# EAGLE design Card4to16 (EAGLE 8.0.1)
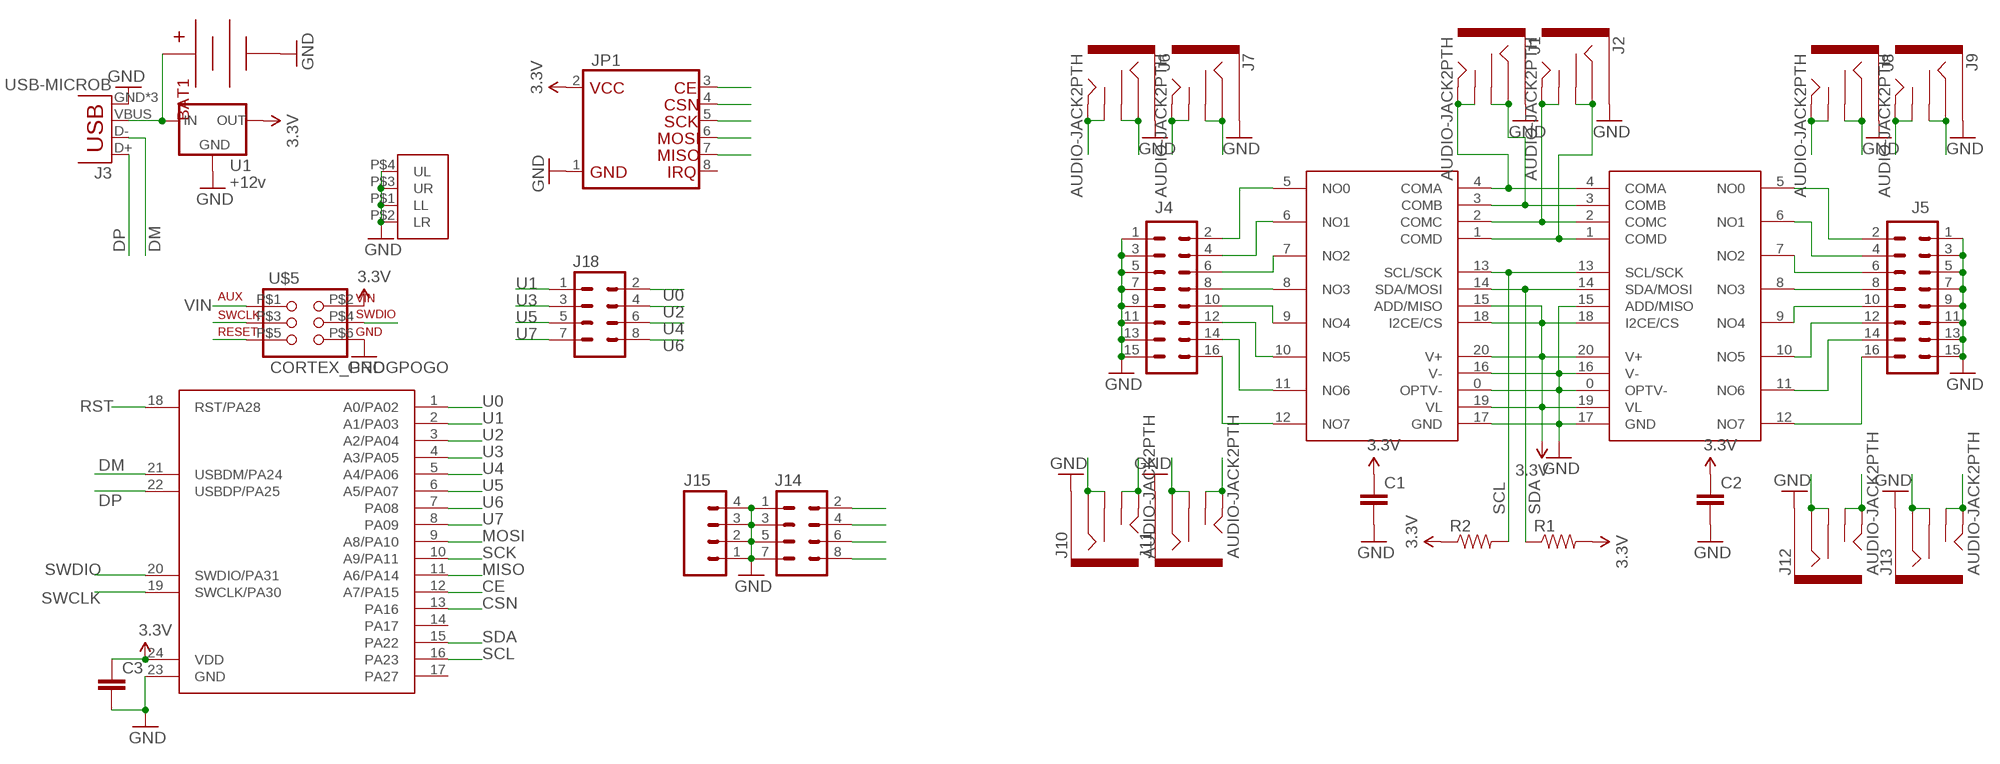
[diagram p0: schematic, sheet 1]

## Parts
BAT1  9VHOLDERCLIPS  [BSPC9V]
C1  CAP0805  [0805]
C2  CAP0805  [0805]
C3  CAP0805  [0805]
J1  AUDIO-JACK2PTH  [AUDIO-JACK]
J2  AUDIO-JACK2PTH  [AUDIO-JACK]
J3  USB-MICROB  [USB-MICROB]
J4  M08X2  [2X8]
J5  M08X2  [2X8]
J6  AUDIO-JACK2PTH  [AUDIO-JACK]
J7  AUDIO-JACK2PTH  [AUDIO-JACK]
J8  AUDIO-JACK2PTH  [AUDIO-JACK]
J9  AUDIO-JACK2PTH  [AUDIO-JACK]
J10  AUDIO-JACK2PTH  [AUDIO-JACK]
J11  AUDIO-JACK2PTH  [AUDIO-JACK]
J12  AUDIO-JACK2PTH  [AUDIO-JACK]
J13  AUDIO-JACK2PTH  [AUDIO-JACK]
J14  M04X2  [2X4]
J15  M04PTH  [1X04]
J18  M04X2  [2X4]
JP1  NRF24L01+SHORT_FLUSH  [NRF24L01SHORT]
R1  RESISTOR0603-RES  [0603-RES]
R2  RESISTOR0603-RES  [0603-RES]
U1  +12v  V_REG_78XX7812  [TO-252]
U$1  MAX14724ETP+QFN  [QFN20_4X4]
U$2  MAX14724ETP+QFN  [QFN20_4X4]
U$3  ATSAMD11D14A-M  [QFN24_4X4]
U$4  CARD_HOLESHOLES  [IEC-7810_ID-1_HOLES]
U$5  CORTEX_PROGPOGO  [2X3_MAX]

## Nets
3.3V: C1.1 C2.1 C3.1 JP1.2(VCC) R1.2 R2.1 U1.2(OUT) U$1.15(ADD/MISO) U$1.18(I2CE/CS) U$1.19(VL) U$1.20(V+) U$2.18(I2CE/CS) U$2.19(VL) U$2.20(V+) U$3.24(VDD) U$5.P$2(VIN)
CE: JP1.3(CE) U$3.12(A7/PA15)
COMA: J1.TIP J1.TSH J14.2 U$1.4(COMA) U$2.4(COMA)
COMB: J1.RING J1.RSH J14.4 U$1.3(COMB) U$2.3(COMB)
COMC: J2.TIP J2.TSH J14.6 U$1.2(COMC) U$2.2(COMC)
COMD: J2.RING J2.RSH J14.8 U$1.1(COMD) U$2.1(COMD)
CSN: JP1.4(CSN) U$3.13(PA16)
DM: J3.D- U$3.21(USBDM/PA24)
DP: J3.D+ U$3.22(USBDP/PA25)
GND: BAT1.P$1(V-) BAT1.P$2(V-) BAT1.P$3(V-) C1.2 C2.2 C3.2 J1.SLEEVE J2.SLEEVE J3.GND J3.MT1(GND) J3.MT2(GND) J4.1 J4.3 J4.5 J4.7 J4.9 J4.11 J4.13 J4.15 J5.1 J5.3 J5.5 J5.7 J5.9 J5.11 J5.13 J5.15 J6.SLEEVE J7.SLEEVE J8.SLEEVE J9.SLEEVE J10.SLEEVE J11.SLEEVE J12.SLEEVE J13.SLEEVE J14.1 J14.3 J14.5 J14.7 J15.1 J15.2 J15.3 J15.4 JP1.1(GND) U1.3(GND) U$1.0(OPTV-) U$1.16(V-) U$1.17(GND) U$2.0(OPTV-) U$2.15(ADD/MISO) U$2.16(V-) U$2.17(GND) U$3.23(GND) U$4.P$1(LL) U$4.P$2(LR) U$4.P$3(UR) U$4.P$4(UL) U$5.P$6(GND)
MISO: JP1.7(MISO) U$3.11(A6/PA14)
MOSI: JP1.6(MOSI) U$3.9(A8/PA10)
OUT1: J4.2 J10.RING J10.RSH U$1.5(NO0)
OUT2: J4.4 J10.TIP J10.TSH U$1.6(NO1)
OUT3: J4.6 J11.RING J11.RSH U$1.7(NO2)
OUT4: J4.8 J11.TIP J11.TSH U$1.8(NO3)
OUT5: J4.10 J12.RING J12.RSH U$1.9(NO4)
OUT6: J4.12 J12.TIP J12.TSH U$1.10(NO5)
OUT7: J4.14 J13.RING J13.RSH U$1.11(NO6)
OUT8: J4.16 J13.TIP J13.TSH U$1.12(NO7)
OUT9: J5.2 J6.RING J6.RSH U$2.5(NO0)
OUT10: J5.4 J6.TIP J6.TSH U$2.6(NO1)
OUT11: J5.6 J7.RING J7.RSH U$2.7(NO2)
OUT12: J5.8 J7.TIP J7.TSH U$2.8(NO3)
OUT13: J5.10 J8.RING J8.RSH U$2.9(NO4)
OUT14: J5.12 J8.TIP J8.TSH U$2.10(NO5)
OUT15: J5.14 J9.RING J9.RSH U$2.11(NO6)
OUT16: J5.16 J9.TIP J9.TSH U$2.12(NO7)
RST: U$3.18(RST/PA28) U$5.P$5(RST)
SCK: JP1.5(SCK) U$3.10(A9/PA11)
SCL: R2.2 U$1.13(SCL/SCK) U$2.13(SCL/SCK) U$3.16(PA23)
SDA: R1.1 U$1.14(SDA/MOSI) U$2.14(SDA/MOSI) U$3.15(PA22)
SWCLK: U$3.19(SWCLK/PA30) U$5.P$3(SWCLK)
SWDIO: U$3.20(SWDIO/PA31) U$5.P$4(SWDIO)
U0: J18.2 U$3.1(A0/PA02)
U1: J18.1 U$3.2(A1/PA03)
U2: J18.4 U$3.3(A2/PA04)
U3: J18.3 U$3.4(A3/PA05)
U4: J18.6 U$3.5(A4/PA06)
U5: J18.5 U$3.6(A5/PA07)
U6: J18.8 U$3.7(PA08)
U7: J18.7 U$3.8(PA09)
VIN: BAT1.P$4(V+) BAT1.P$5(V+) BAT1.P$6(V+) J3.VBUS U1.1(IN) U$5.P$1(AUX)
Unconnected: JP1.8(IRQ) U$3.14(PA17) U$3.17(PA27)

## Library data of the parts
BAT1 = maxorig:9VHOLDER: 9V board-mount battery cradle
C1-C3 = SparkFun-Capacitors:CAP: Capacitor Standard 0603 ceramic capacitor, and 0.1" leaded capacitor.
J1 J2 J6-J13 = SparkFun-Connectors:AUDIO-JACK2: Stereo audio jack with bypass switches. SMT version used on LilyPad MP3 board.; PROD_ID: CONN-08774
J3 = SparkFun-Connectors:USB: USB Connectors USB-B-PTH is fully proven SKU : PRT-00139/CONN-08278 USB-miniB is fully proven SKU : PRT-00587 USB-A-PCB is untested. USB-A-H is throughly reviewed, but untested. Spark Fun Electronics SKU : PRT-00437 USB-B-SMT is throughly reviewed, but untested. Needs silkscreen touching up. USB-A-S has not been used/tested USB-MB-H has not been used/tested USB-MICROB has been used. CONN-09505; PROD_ID: CONN-09505
J4 J5 = SparkFun-Connectors:M08X2: .1" headers, two rows of 8 each
J14 J18 = SparkFun-Connectors:M04X2: .1" header, two rows of four.
J15 = SparkFun-Connectors:M04: Header 4 Standard 4-pin 0.1" header. Use with straight break away headers (SKU : PRT-00116), right angle break away headers (PRT-00553), swiss pins (PRT-00743), machine pins (PRT-00117), and female headers (PRT-00115). Molex polarized connector foot print use with SKU : PRT-08231 with associated crimp pins and housings. 1MM SMD Version SKU: PRT-10208; PROD_ID: CONN-09696
JP1 = maxorig:NRF24L01+: Low cost 2.4GHZ ISM radio with extensive Arduino support and mesh networking support. Flush package has holes to allow for entire module to sit flush to PCB if header spacers removed due to through-hole crystal used. Short version has keepout area for trace antenna onboard to avoid signal dampening. Long version's anchor pins are tied to GND but are not required for operation.
R1 R2 = SparkFun-Resistors:RESISTOR: Resistor Basic schematic elements and footprints for 0603, 1206, and PTH resistors.
U1 = SparkFun-PowerIC:V_REG_78XX: Voltage Regulator Standard 78xx regulator. IGO (Input Ground Output). Spark Fun Electronics SKU : COM-00107; PROD_ID: VREG-12370
U$1 U$2 = maxorig:MAX14724ETP+: I2C / SPI mux, 4 to 8 channel, 3 ohm. Great for audio routing, with low resistance and quad busses. Each normally open pin can be tied to any combination or none of the shared busses. I2C mode has 1 address pin for a total of 2 possible addresses.
U$3 = maxorig:ATSAMD11D14A-M: Low pin count 32-bit Cortex M0+ microcontroller in qfn package, USB, 3 sercoms, 10 analog inputs, 22 gpio pins
U$4 = maxorig:CARD_HOLES: Business card size board outline meeting IEC-7810 ID-1 standards. To fully meet spec, use with a 0.6mm or 0.8mm thick PCB. Holes are individually broken out but shoud ideally be tied to ground for connection with metallic enclosure. Paneled versions are 50mm high vs the 53mm in the spec to allow for two to be fit on a 100x100mm board for cost reductions.
U$5 = maxorig:CORTEX_PROG: 2x3 0.1' connector for programming and debugging Cortex M0(+) MCUs Has auxiliary pin broken out for extra testing functionality

## Board
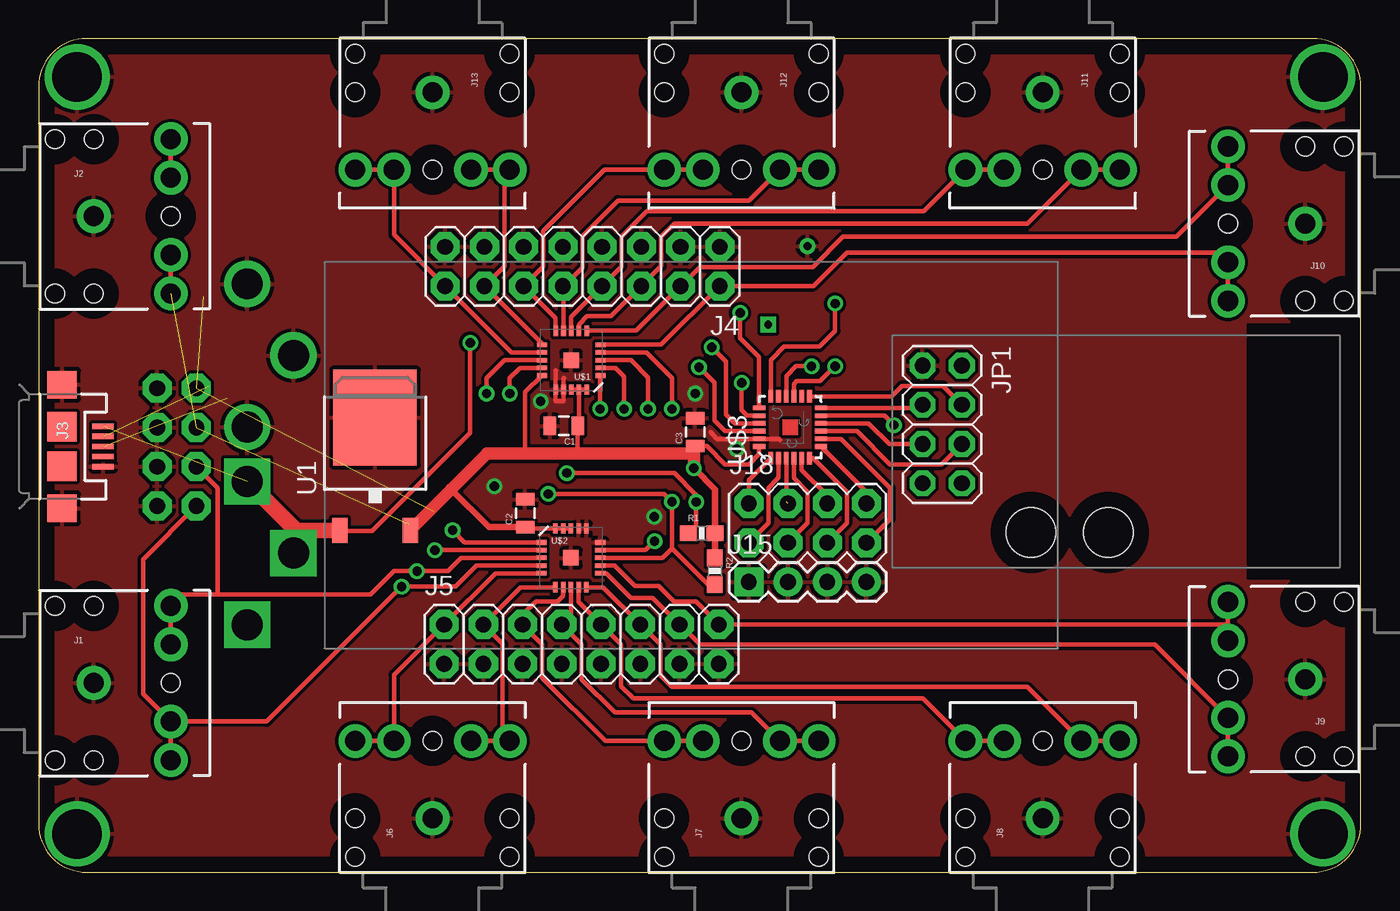
[diagram p1: board, top side]
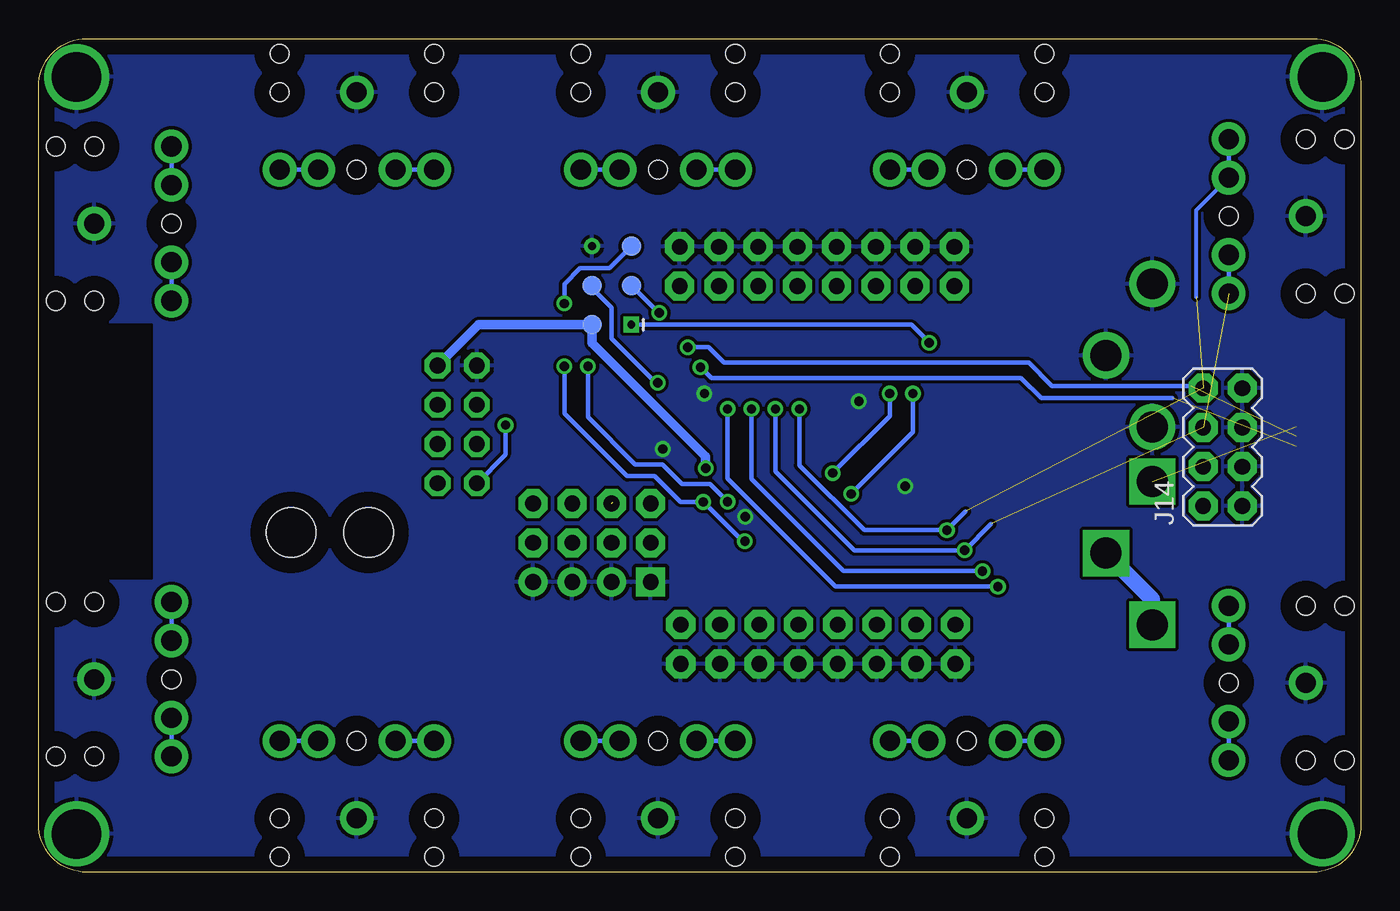
[diagram p2: board, bottom side, seen from below]

Size 85.6 x 53.98 mm. Coordinates in mm from the lower left corner, seen from the top.
Copper layers (1*16): Top 0.035mm / dielectric 1.5mm / Bottom 0.035mm
Design rules "default": minimum track width 10mil, minimum drill 24mil, track to track 8mil, track to pad 8mil, pad to pad 8mil, via to via 8mil, smd to smd 8mil, copper to edge 40mil, drill to drill 8mil, minimum pad ring 10mil, minimum via ring 8mil, stop-mask expansion 4mil, vias tented up to drill 0mil, thermal gap 10mil

### Footprints (pad centres in the part's own frame; a part is rotated, then mirrored left to right if it is on the bottom)
BSPC9V = drill 2: P$1 0,22.1; P$2 0,12.83; P$3 3,17.465 | drill 2 square: P$4 0,9.3; P$5 0,0.03; P$6 3,4.665
0805 = smd 0.8 x 1.2: 1 -0.9,0; 2 0.9,0
AUDIO-JACK = drill 1.3 pad 2.184: RING 5,5; RSH 5,2.5; SLEEVE 0,0; TIP 5,-5; TSH 5,-2.5 | hole 1.2: 0,5; -2.5,5; -2.5,-5; 0,-5; 5,0
USB-MICROB = smd 0.35 x 1.4: D+ 0,2.65; D- -0.65,2.65; GND 1.3,2.65; ID 0.65,2.65; VBUS -1.3,2.65 | smd 1.8 x 1.9: MT1 -4,0; MT2 4,0 | smd 1.9 x 1.9: P$1 -1.27,0; P$2 1.27,0
2X8 = drill 1.016 pad 1.88 octagon: 1 0,0; 2 0,2.54; 3 2.54,0; 4 2.54,2.54; 5 5.08,0; 6 5.08,2.54; 7 7.62,0; 8 7.62,2.54; 9 10.16,0; 10 10.16,2.54; 11 12.7,0; 12 12.7,2.54; 13 15.24,0; 14 15.24,2.54; 15 17.78,0; 16 17.78,2.54
2X4 = drill 1.016 pad 1.88 octagon: 1 -3.81,-1.27; 2 -3.81,1.27; 3 -1.27,-1.27; 4 -1.27,1.27; 5 1.27,-1.27; 6 1.27,1.27; 7 3.81,-1.27; 8 3.81,1.27
1X04 = drill 1.016 pad 1.88 square: 1 0,0 | drill 1.016 pad 1.88: 2 2.54,0; 3 5.08,0; 4 7.62,0
NRF24L01SHORT = drill 1.016 pad 1.676 octagon: 1 -3.81,-1.27; 2 -3.81,1.27; 3 -1.27,-1.27; 4 -1.27,1.27; 5 1.27,-1.27; 6 1.27,1.27; 7 3.81,-1.27; 8 3.81,1.27 | hole 3.2: 7,5.75; 7,10.75
0603-RES = smd 1.1 x 1: 1 -0.85,0; 2 0.85,0
TO-252 = smd 1 x 1.6: 1 -2.28,-4.8; 2 2.28,-4.8 | smd 5.4 x 6.2: 3 0,2.5
QFN20_4X4 = smd 1 x 1: 0 0,0 | smd 0.65 x 0.3: 1 -1.9,1; 2 -1.9,0.5; 3 -1.9,0; 4 -1.9,-0.5; 5 -1.9,-1; 11 1.9,-1; 12 1.9,-0.5; 13 1.9,0; 14 1.9,0.5; 15 1.9,1 | smd 0.3 x 0.65: 6 -1,-1.9; 7 -0.5,-1.9; 8 0,-1.9; 9 0.5,-1.9; 10 1,-1.9; 16 1,1.9; 17 0.5,1.9; 18 0,1.9; 19 -0.5,1.9; 20 -1,1.9
QFN24_4X4 = smd 0.8 x 0.3: 1 -2,1.25; 2 -2,0.75; 3 -2,0.25; 4 -2,-0.25; 5 -2,-0.75; 6 -2,-1.25; 13 2,-1.25; 14 2,-0.75; 15 2,-0.25; 16 2,0.25; 17 2,0.75; 18 2,1.25 | smd 0.3 x 0.8: 7 -1.25,-2; 8 -0.75,-2; 9 -0.25,-2; 10 0.25,-2; 11 0.75,-2; 12 1.25,-2; 19 1.25,2; 20 0.75,2; 21 0.25,2; 22 -0.25,2; 23 -0.75,2; 24 -1.25,2
IEC-7810_ID-1_HOLES = drill 3.2: P$1 2.49,2.49; P$2 83.135,2.49; P$3 83.135,51.5; P$4 2.49,51.5
2X3_MAX = drill 0.508 square: P$1 -2.54,-1.27 | smd 1.27 x 1.27: P$2 -2.54,1.27; P$3 0,-1.27; P$4 0,1.27; P$5 2.54,-1.27 | drill 0.508: P$6 2.54,1.27

### Placement (x,y rotation side)
BAT1  13.5,16 0 top
C1  34,28.9 180 top
C2  31.5,23.25 90 top
C3  42.5,28.5 90 top
J1  3.56,12.26 0 top
J2  3.56,42.48 0 top
J3  1.52,27.57 270 top
J4  44.1,40.5 180 top
J5  26.25,13.5 0 top
J6  25.5,3.5 90 top
J7  45.5,3.5 90 top
J8  65,3.5 90 top
J9  82,12.5 180 top
J10  82,42 180 top
J11  65,50.5 270 top
J12  45.5,50.5 270 top
J13  25.5,50.5 270 top
J14  8.94,27.53 90 bottom
J15  45.97,18.8 0 top
J18  49.78,22.61 0 top
JP1  58.5,29 270 top
R1  42.93,21.95 0 top
R2  43.77,19.5 270 top
U1  21.78,26.94 0 top
U$1  34.48,33.16 180 top
U$2  34.46,20.36 0 top
U$3  48.65,28.82 90 top
U$4  0,0 0 top
U$5  48.5,38 90 bottom

### Tracks (layer width: path | path; a pad name or v marks a point on that pad's centre or on a via)
3.3V  (via drill 0.6)
  Top 0.305: U$2.18 U$2.19 U$2.20 32.14,22.26 C2.1 | U$1.19 U$1.20 | U$1.19 U$1.18 | 42.53,27.57 C3.1 43.27,27.6 44.45,26.42 45.97,26.42 46.65,27.09 U$3.24 | 31.5,27.1 31.5,31.08 U$1.15 | U$1.19 34.98,28.98 C1.1 34.9,27.1
  Top 0.406: C2.1 29.15,22.35 26.71,24.79 | v42.42,26.16 43.78,24.8 R1.2 R2.1
  Top 0.813: U1.2 26.71,24.79 29.02,27.1 31.5,27.1 34.9,27.1 42,27.1 C3.1 42.42,27.52 v42.42,26.16
  Bottom 0.305: U$5.P$2 49.78,35.45
  Bottom 0.406: U$5.P$2 49.77,35.07
  Bottom 0.61: JP1.2 57.12,35.46 U$5.P$2 49.77,34.28 42.42,26.92 v42.42,26.16
CE
  Top 0.305: U$3.12 57.03,30.07 JP1.3
COMA  (via drill 0.6)
  Top 0.305: 29.36,19.86 U$2.4 28.36,19.86 27,18.5 v23.5,18.5 14.76,9.76 J1.TSH | v41,30 41,32 39.34,33.66 U$1.4 | J1.TIP J1.TSH | J1.TSH 6.76,11.56 6.76,20.27 J14.2
  Bottom 0.305: v23.5,18.5 34,18.5 41,25.5 v41,30 | J1.TSH J1.TIP
COMB  (via drill 0.6)
  Top 0.305: 13.72,18 21.5,18 23,19.5 v24.5,19.5 26.5,19.5 27.36,20.36 U$2.3 | 13.72,18 9.3,18 J1.RING J1.RSH | U$1.3 38.34,33.16 39.45,32.05 v39.45,30 | 11.58,20.28 11.58,20.32 | 11.58,20.32 11.58,24.89 J14.4 | 11.58,20.32 11.58,18 13.72,18
  Bottom 0.305: v24.5,19.5 33.5,19.5 39.45,25.45 v39.45,30 | J1.RSH J1.RING
COMC  (via drill 0.6)  (2 unrouted)
  Top 0.305: U$2.2 26.14,20.86 v25.65,20.85 | U$1.2 37.34,32.66 37.9,32.1 v37.9,30 | J2.TSH J2.TIP
  Bottom 0.305: v25.65,20.85 25.95,21.05 | v25.65,20.85 32.8,20.85 37.9,25.95 v37.9,30 | 23.95,22.55 v25.65,20.85 | J2.TSH J2.TIP
COMD  (via drill 0.6)  (2 unrouted)
  Top 0.305: v36.35,30 36.35,32.13 U$1.1 | U$2.1 27.59,21.36 v26.8,22.15 | J2.RSH J2.RING
  Bottom 0.254: J2.RSH 10.67,42.87 10.67,37.26
  Bottom 0.305: 25.6,23.35 v26.8,22.15 32.15,22.15 36.35,26.35 v36.35,30 | J2.RING J2.RSH
CSN
  Top 0.305: JP1.4 58.54,31.5 55.88,31.5 55.2,30.82 U$3.13
DM  (via drill 0.6)  (1 unrouted)
  Top 0.305: U$3.21 45.07,29.07 44.49,29.65 44.49,33.09 v43.58,34
  Bottom 0.305: 11,31.5 20,31.5 21.5,33 41.24,33 42.24,34 v43.58,34
DP  (via drill 0.6)  (1 unrouted)
  Top 0.305: U$3.22 44.43,28.57 43.75,29.25 43.75,31.7 v42.75,32.7
  Bottom 0.305: 12.2,30.7 20.7,30.7 22,32 42.04,32 v42.75,32.7
GND  (via drill 0.6)
  Top 0.305: 33.5,32.5 33.48,32.5 U$1.16 33.48,30.5 33.98,30.5 U$1.17 33.98,32 34,32 | 43.5,28.5 43.93,28.07 U$3.23 47.93,28.07 48,28
  other vias: 32.5,30.5 29.5,25 45.2,27.41 42.5,31 39.86,23.02
  pour Bottom: -5,-2.5 -5.5,57.5 89,56.5 90,-3.5
  pour Top: 89.5,-3.5 89.5,56.5 -5.5,56 -5,-2.5
MISO  (via drill 0.6)
  Top 0.305: U$3.11 54.76,29.57 v55.37,28.96
  Bottom 0.305: v55.37,28.96 55.37,27.05 JP1.7
MOSI
  Top 0.305: U$3.9 52.96,28.57 55.12,26.42 58.46,26.42 JP1.6
OUT1
  Top 0.305: U$1.5 40.3,34.16 J4.2 50.15,37.96 52.32,40.13 76.37,40.13 J10.RSH J10.RING
  Bottom 0.305: J10.RING J10.RSH
OUT2
  Top 0.305: U$1.6 38.66,35.06 J4.4 42.8,39.2 50.12,39.2 52.07,41.15 73.65,41.15 J10.TSH J10.TIP
  Bottom 0.305: J10.TSH J10.TIP
OUT3
  Top 0.305: U$1.7 34.98,35.48 35.5,36 37.06,36 J4.6 40.3,39.24 40.3,41.15 41.15,42 64,42 J11.RSH J11.RING
  Bottom 0.305: J11.RING J11.RSH
OUT4
  Top 0.305: U$1.8 34.48,35.96 J4.8 37.75,39.23 37.75,41.15 39.4,42.8 57.3,42.8 J11.TIP J11.TSH
  Bottom 0.305: J11.TSH J11.TIP
OUT5
  Top 0.305: U$1.9 33.98,37.92 J4.10 34.01,37.96 35.2,39.15 35.2,41.2 37.5,43.5 46,43.5 J12.RSH J12.RING
  Bottom 0.305: J12.RING J12.RSH
OUT6
  Top 0.305: U$1.10 33.48,35.88 J4.12 32.65,39.21 32.65,41.5 36.65,45.5 J12.TIP J12.TSH
  Bottom 0.305: J12.TSH J12.TIP
OUT7
  Top 0.305: U$1.11 32.58,34.24 J4.14 30.15,39.25 30.15,45.15 J13.RING J13.RSH
  Bottom 0.305: J13.RING J13.RSH
OUT8
  Top 0.305: U$1.12 30.62,33.66 J4.16 23,41.28 J13.TSH J13.TIP
  Bottom 0.305: J13.TIP J13.TSH
OUT9
  Top 0.305: U$2.5 29.57,19.36 J5.2 23,12.79 J6.RSH J6.RING
  Bottom 0.305: J6.RING J6.RSH
OUT10
  Top 0.305: U$2.6 31.21,18.46 J5.4 30.05,14.78 30.05,8.95 J6.TIP J6.TSH
  Bottom 0.305: J6.TSH J6.TIP
OUT11
  Top 0.305: U$2.7 33.96,17.91 33.6,17.55 32.2,17.55 31.3,16.65 31.3,16.07 J5.6 32.6,14.77 32.6,12.6 36.7,8.5 J7.RING J7.RSH
  Bottom 0.305: J7.RSH J7.RING
OUT12
  Top 0.305: U$2.8 34.46,16.63 J5.8 35.15,14.76 35.15,12.5 37.3,10.35 46.15,10.35 J7.TSH J7.TIP
  Bottom 0.305: J7.TSH J7.TIP
OUT13
  Top 0.305: U$2.9 34.96,17.49 J5.10 37.7,14.75 37.7,12.05 38.5,11.25 57.25,11.25 J8.RING J8.RSH
  Bottom 0.305: J8.RING J8.RSH
OUT14
  Top 0.305: U$2.10 36.53,18.46 J5.12 40.25,14.75 40.25,12.75 41,12 64,12 J8.TSH J8.TIP
  Bottom 0.305: J8.TSH J8.TIP
OUT15
  Top 0.305: U$2.11 36.77,19.36 38.35,17.78 39.75,17.78 J5.14 41.51,16.04 42.8,14.75 72.25,14.75 J9.RSH J9.RING
  Bottom 0.305: J9.RING J9.RSH
OUT16
  Top 0.305: U$2.12 37.29,19.86 38.61,18.54 40.13,18.54 41.15,17.53 42.54,17.53 J5.16 77,16.04 77,16.51 | 77,16.51 J9.TIP | 77,16.51 J9.TSH
  Bottom 0.305: J9.TSH J9.TIP
RST  (via drill 0.6)
  Top 0.305: U$3.18 47.4,33.18 48.26,34.04 50.55,34.04 51.56,35.05 v51.56,36.83
  Bottom 0.305: v51.56,36.83 51.56,38.1 50.55,39.12 48.65,39.12 U$5.P$5
SCK
  Top 0.305: U$3.10 53.73,29.07 55.07,27.73 JP1.5
SCL  (via drill 0.6)
  Top 0.305: v33,24.5 40.5,24.5 v41,24 41,20.98 | U$1.13 30.16,33.16 29,32 v29,31 | R2.2 43.32,18.65 41,20.98 | U$3.16 48.4,32.14 49.02,32.77 v50.04,32.77 | U$2.13 40.38,20.36 41,20.98
  Bottom 0.305: v29,31 29,28.5 v33,24.5 | v41,24 42.15,25.15 43.94,25.15 45.21,26.42 46.99,26.42 50.04,29.46 v50.04,32.77
SDA  (via drill 0.6)
  Top 0.305: U$1.14 31.16,32.66 30.5,32 v30.5,31 | v34.2,25.85 41.15,25.85 42.57,24.43 v42.57,23.98 42.57,22.44 R1.1 | U$2.14 39.3,20.86 v39.88,21.44 | U$3.15 48.9,31.63 49.07,31.8 50.6,31.8 v51.56,32.77
  Bottom 0.305: v34.2,25.85 30.5,29.55 v30.5,31 | v39.88,21.44 40.03,21.44 v42.57,23.98 44.04,23.98 45.72,25.65 47.5,25.65 51.56,29.72 v51.56,32.77
SWCLK  (via drill 0.6)
  Top 0.305: U$3.19 46.65,33.36 45.41,34.59 v45.41,36.22
  Bottom 0.305: v45.41,36.22 45.45,36.22 U$5.P$3
SWDIO  (via drill 0.6)
  Top 0.305: v45.52,31.7 45.52,29.92 45.87,29.57 U$3.20
  Bottom 0.305: U$5.P$4 49.77,37.83 48.51,36.58 48.51,34.54 45.67,31.7 v45.52,31.7
U0
  Top 0.305: U$3.1 45.97,25.39 J18.2
U1
  Top 0.305: 47.9,26.56 U$3.2 47.9,25.55 47.24,24.89 47.24,22.61 J18.1
U2  (1 unrouted)
  Top 0.305: 48.4,23.99 U$3.3
U3
  Top 0.305: U$3.4 48.9,25.52 49.78,24.64 49.78,22.61 J18.3
U4
  Top 0.305: U$3.5 49.4,26.04 51.05,24.38 J18.6
U5
  Top 0.305: U$3.6 50.14,26.82 52.32,24.64 52.32,22.61 J18.5
U6
  Top 0.305: U$3.7 53.59,24.63 J18.8
U7
  Top 0.305: U$3.8 51.94,28.07 55.12,24.89 55.12,22.86 J18.7
VIN  (via drill 0.6)  (1 unrouted)
  Top 0.305: v27.94,34.29 27.94,28.45 21.59,22.1 19.46,22.1 U1.1
  Top 1.016: BAT1.P$6 16.5,22 | 16.5,22 16.5,22.3 BAT1.P$4 | U1.1 16.64,22.14 16.5,22
  Bottom 0.305: U$5.P$1 29.11,35.46 v27.94,34.29
  Bottom 1.016: BAT1.P$5 13.5,17.66 BAT1.P$6